# EAGLE design 210_gpio (EAGLE 9.6.2)
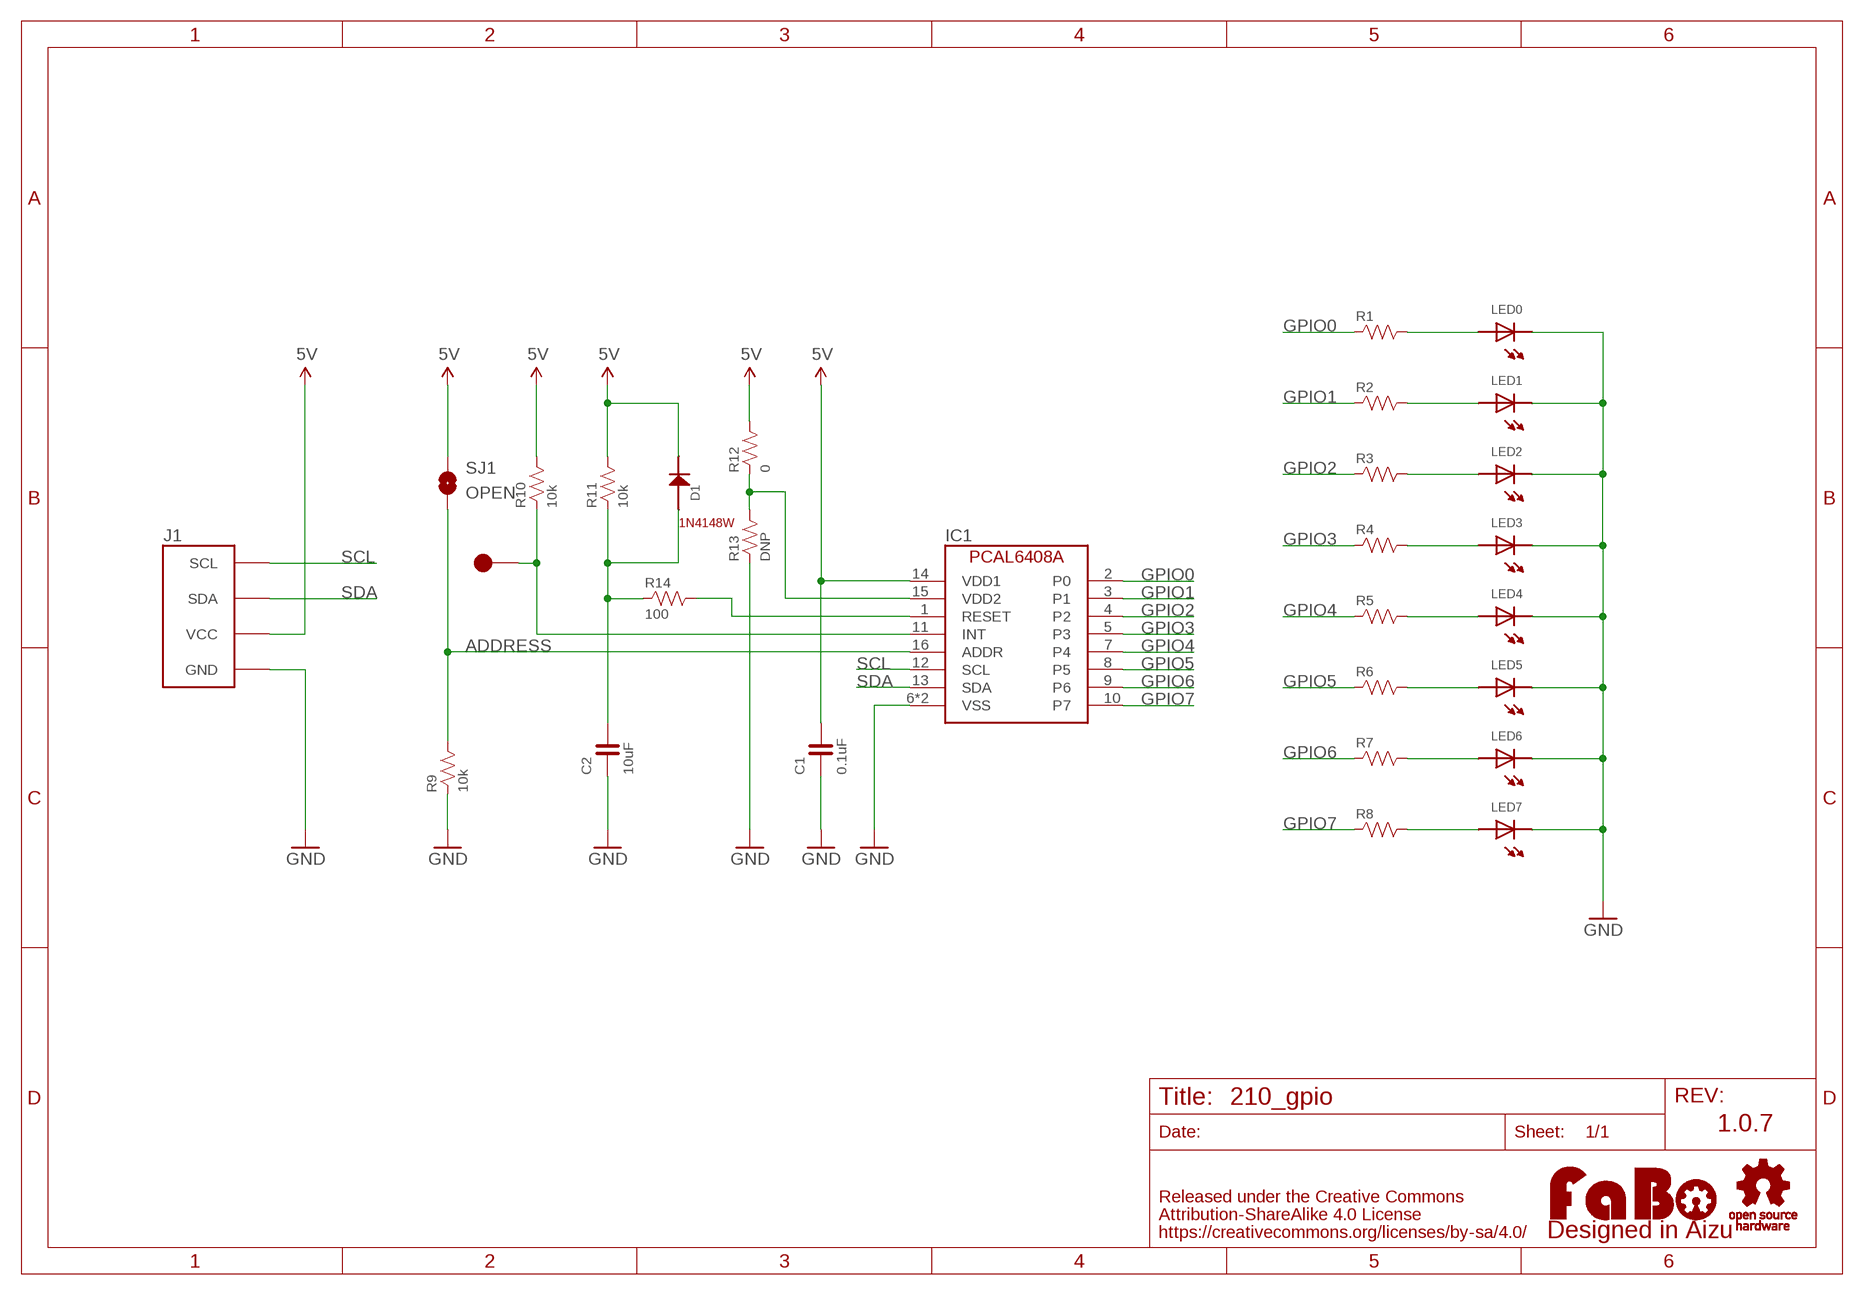
[diagram p0: schematic, sheet 1]

## Parts
C1  0.1uF  CAPACITOR-0603  [0603]
C2  10uF  CAPACITOR-0805  [0805]
D1  1N4148  [1N4148W]
IC1  NX-PCAL6408A  [NXP-PCAL6408A]
J1  FABO_BRICK_I2C  [FABO_BRICK_I2C]
LED0  LED-0603-NARROW  [0603-NARROW]
LED1  LED-0603-NARROW  [0603-NARROW]
LED2  LED-0603-NARROW  [0603-NARROW]
LED3  LED-0603-NARROW  [0603-NARROW]
LED4  LED-0603-NARROW  [0603-NARROW]
LED5  LED-0603-NARROW  [0603-NARROW]
LED6  LED-0603-NARROW  [0603-NARROW]
LED7  LED-0603-NARROW  [0603-NARROW]
LOGO1  LOGO_FABO-M  [LOGO_FABO_M]
R1  RESISTOR-0603-NARROW  [0603-NARROW]
R2  RESISTOR-0603-NARROW  [0603-NARROW]
R3  RESISTOR-0603-NARROW  [0603-NARROW]
R4  RESISTOR-0603-NARROW  [0603-NARROW]
R5  RESISTOR-0603-NARROW  [0603-NARROW]
R6  RESISTOR-0603-NARROW  [0603-NARROW]
R7  RESISTOR-0603-NARROW  [0603-NARROW]
R8  RESISTOR-0603-NARROW  [0603-NARROW]
R9  10k  RESISTOR-0603-NARROW  [0603-NARROW]
R10  10k  RESISTOR-0603-NARROW  [0603-NARROW]
R11  10k  RESISTOR-0603-NARROW  [0603-NARROW]
R12  0  RESISTOR-0603-NARROW  [0603-NARROW]
R13  DNP  RESISTOR-0603-NARROW  [0603-NARROW]
R14  100  RESISTOR-0603-NARROW  [0603-NARROW]
SJ1  OPEN  SMD-JUMPER-2-OPEN  [SMD-JUMPER-2-OPEN]
TP1  TP-15  [TP-15]
U$2  LOGO_OSHW-M_BOTTOM  [LOGO_OSHW_M_BOTTOM]

## Nets
5V: C1.2 D1.CATHODE IC1.14(VDD1) J1.VCC R10.2 R11.2 R12.2 SJ1.1
ADDRESS: IC1.16(ADDR) R9.2 SJ1.2
GND: C1.1 C2.1 IC1.6(VSS) IC1.17(VSS) J1.GND LED0.CATHODE LED1.CATHODE LED2.CATHODE LED3.CATHODE LED4.CATHODE LED5.CATHODE LED6.CATHODE LED7.CATHODE R9.1 R13.1
GPIO0: IC1.2(P0) R1.1
GPIO1: IC1.3(P1) R2.1
GPIO2: IC1.4(P2) R3.1
GPIO3: IC1.5(P3) R4.1
GPIO4: IC1.7(P4) R5.1
GPIO5: IC1.8(P5) R6.1
GPIO6: IC1.9(P6) R7.1
GPIO7: IC1.10(P7) R8.1
N$1: LED0.ANODE R1.2
N$2: LED1.ANODE R2.2
N$3: LED2.ANODE R3.2
N$4: LED3.ANODE R4.2
N$5: LED4.ANODE R5.2
N$6: LED5.ANODE R6.2
N$7: LED6.ANODE R7.2
N$8: LED7.ANODE R8.2
N$9: IC1.11(INT) R10.1 TP1.1
N$10: C2.2 D1.ANODE R11.1 R14.1
N$11: IC1.1(RESET) R14.2
N$12: IC1.15(VDD2) R12.1 R13.2
SCL: IC1.12(SCL) J1.SCL
SDA: IC1.13(SDA) J1.SDA

## Notes on the sheet
- 1N4148W
- 1.0.7

## Library data of the parts
C1 C2 = FaBo-Capacitor:CAPACITOR: CAPACITOR
D1 = FaBo-Diode:1N4148
IC1 = FaBo-Mems:NX-PCAL6408A: NXP PCAL6408A
J1 = FaBo-Template:FABO_BRICK_I2C: FaBo Brick I2C
LED0 LED1-LED7 = FaBo-LED:LED
LOGO1 = component:LOGO_FABO
R1-R14 = FaBo-Resistors:RESISTOR: RESISTOR
SJ1 = FaBo-Supply:SMD-JUMPER-2
TP1 = FaBo-Supply:TP
U$2 = FaBo-etc:LOGO_OSHW

## Board
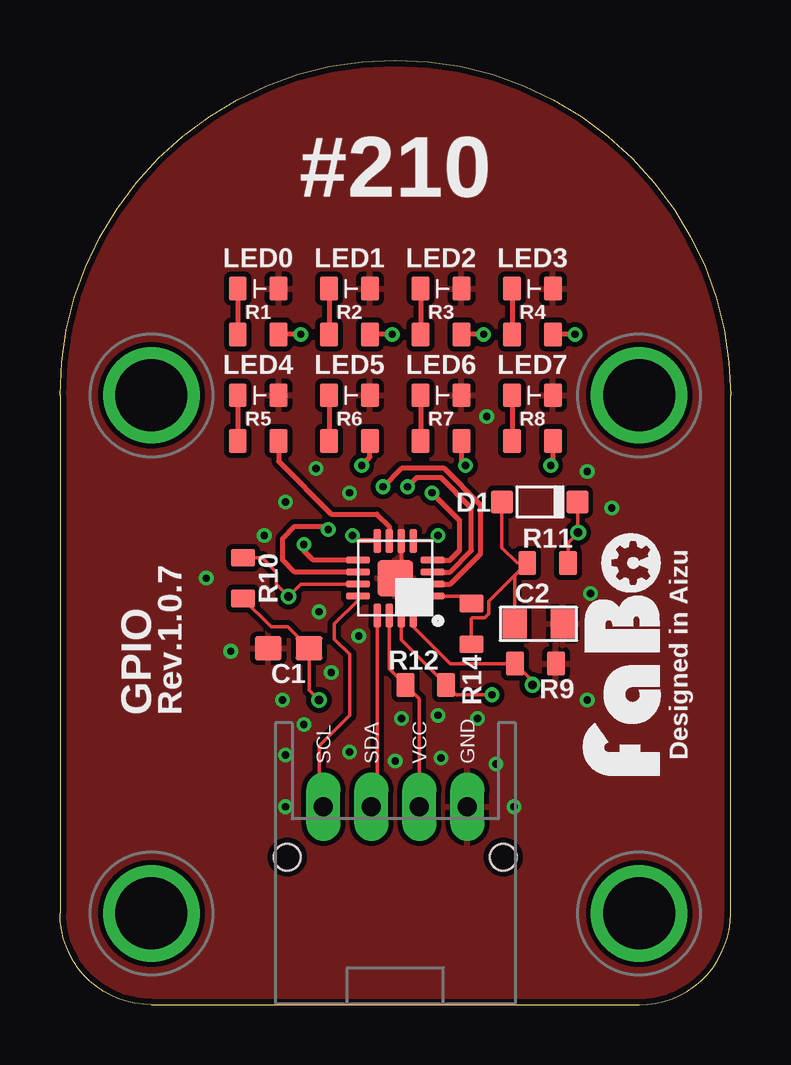
[diagram p1: board, top side]
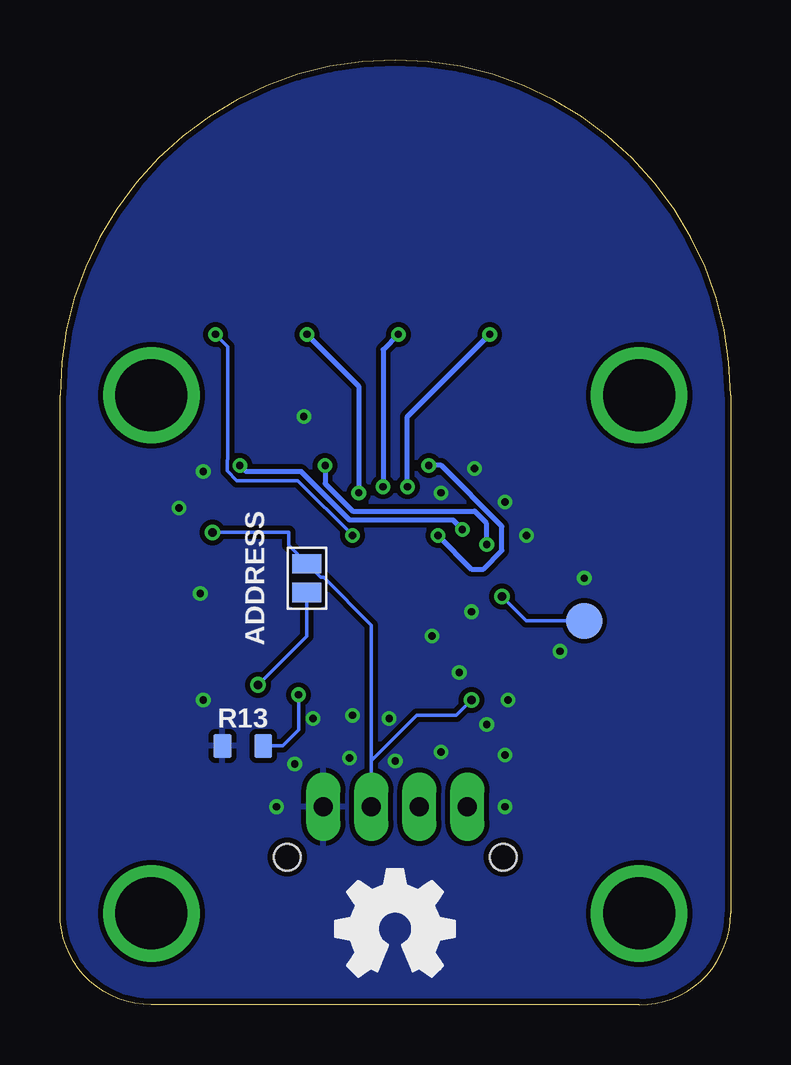
[diagram p2: board, bottom side, seen from below]

Size 27.94 x 39.37 mm. Coordinates in mm from the lower left corner, seen from the top.
Copper layers (1*16): Top 0.035mm / dielectric 1.6mm / Bottom 0.035mm
Design rules "PCBway": minimum track width 6mil, minimum drill 12mil, track to track 6mil, track to pad 6mil, pad to pad 6mil, via to via 6mil, smd to smd 6mil, copper to edge 10mil, drill to drill 10mil, minimum pad ring 10mil, minimum via ring 6mil, stop-mask expansion 2mil, vias tented up to drill 100mil, thermal gap 8mil

### Footprints (pad centres in the part's own frame; a part is rotated, then mirrored left to right if it is on the bottom)
0603 = smd 1.1 x 1: 1 -0.85,0; 2 0.85,0
0805 = smd 1 x 1.2: 1 -1.254,0; 2 0.746,0
1N4148W = smd 0.9 x 0.95: ANODE 0,0; CATHODE 3.15,0
NXP-PCAL6408A = smd 1 x 0.3: 1 -1.55,0.75; 2 -1.55,0.25; 3 -1.55,-0.25; 4 -1.55,-0.75; 9 1.55,-0.75; 10 1.55,-0.25; 11 1.55,0.25; 12 1.55,0.75 | smd 0.3 x 1: 5 -0.75,-1.55; 6 -0.25,-1.55; 7 0.25,-1.55; 8 0.75,-1.55; 13 0.75,1.55; 14 0.25,1.55; 15 -0.25,1.55; 16 -0.75,1.55 | smd 1.5 x 1.5: 17 0,0
FABO_BRICK_I2C = drill 0.8 pad 1.422 long: GND 3,-10.795; SCL -3,-10.795; SDA -1,-10.795; VCC 1,-10.795 | drill 3 pad 3.81: P$1 -10.16,6.35; P$2 10.16,6.35; P$3 -10.16,-15.24; P$4 10.16,-15.24 | hole 1.1: -4.5,-12.895; 4.5,-12.895
0603-NARROW = smd 0.75 x 1: ANODE -0.85,0; CATHODE 0.85,0
0603-NARROW' = smd 0.75 x 1: 1 -0.85,0; 2 0.85,0
SMD-JUMPER-2-OPEN = smd 0.8 x 1.2: 1 -0.6,0; 2 0.6,0
TP-15 = smd 1.5 x 1.5: 1 0,0

### Placement (x,y rotation side)
C1  9.53,14.86 0 top
C2  19.68,15.88 180 top
D1  18.41,20.95 0 top
IC1  13.97,17.78 180 top
J1  13.97,19.05 0 top
LED0  8.26,29.84 0 top
LED1  12.06,29.84 0 top
LED2  15.88,29.84 0 top
LED3  19.68,29.84 0 top
LED4  8.26,25.4 0 top
LED5  12.06,25.4 0 top
LED6  15.88,25.4 0 top
LED7  19.68,25.4 0 top
LOGO1  25.4,14.61 90 top
R1  [0603-NARROW']  8.26,27.94 180 top
R2  [0603-NARROW']  12.06,27.94 180 top
R3  [0603-NARROW']  15.88,27.94 180 top
R4  [0603-NARROW']  19.68,27.94 180 top
R5  [0603-NARROW']  8.26,23.5 180 top
R6  [0603-NARROW']  12.06,23.5 180 top
R7  [0603-NARROW']  15.88,23.5 180 top
R8  [0603-NARROW']  19.68,23.5 180 top
R9  10k  [0603-NARROW']  19.81,14.22 180 top
R10  10k  [0603-NARROW']  7.62,17.78 270 top
R11  10k  [0603-NARROW']  20.32,18.41 0 top
R12  0  [0603-NARROW']  15.24,13.34 180 top
R13  DNP  [0603-NARROW']  20.32,10.79 0 bottom
R14  100  [0603-NARROW']  17.14,15.88 90 top
SJ1  17.65,17.78 270 bottom
TP1  6.1,16 270 bottom
U$2  13.97,3.17 0 top

### Tracks (layer width: path | path; a pad name or v marks a point on that pad's centre or on a via)
5V  (via drill 0.35)
  Top 0.152: R11.2 21.17,19.27 v21.59,19.68 21.57,19.71 D1.CATHODE | R10.2 8.8,15.75 9.49,15.75 C1.2 10.38,13.12 v10.79,12.7 | IC1.14 13.72,14.01 R12.2 14.97,12.76 J1.VCC
  Bottom 0.152: v21.59,19.68 18.41,19.68 18.41,19.14 SJ1.1 17.08,17.81 16.96,17.81 14.97,15.82 J1.VCC 14.97,10.18 13.08,12.06 11.43,12.06 v10.79,12.7
ADDRESS  (via drill 0.35)
  Top 0.152: 14.72,16.14 14.72,15.76 16.26,14.22 R9.2 19.68,13.5 v19.68,13.34
  Top 0.203: IC1.16 14.72,16.14
  Bottom 0.152: v19.68,13.34 17.65,15.37 SJ1.2
GND  (via drill 0.3)
  Top 0.152: IC1.6 14.22,18.03 IC1.17
  other vias: 12.06,10.54 12.45,15.37 11.3,13.84 10.16,11.68 13.97,10.16 15.88,10.29 15.75,12.06 10.79,16.38 8.51,19.56 9.4,20.95 10.67,22.35 12.06,21.34 17.78,24.51 21.97,22.23 22.99,20.7 22.1,17.14 9.27,12.7 7.11,14.73 6.1,17.78 9.4,8.26 9.4,10.41 18.92,8.26 21.97,12.7 17.4,11.94 18.16,10.03 14.22,11.94
  pour Top (isolate 0.203): 0,0 27.94,0 27.94,39.37 0,39.37
  pour Bottom (isolate 0.203): 0,0 27.94,0 27.94,39.37 0,39.37
GPIO0  (via drill 0.3)
  Top 0.203: IC1.2 16.26,17.53 17.53,18.8 17.53,20.83 16,22.35 14.22,22.35 v13.46,21.59 | v10.03,27.94 R1.1
  Bottom 0.203: v13.46,21.59 13.46,24.51 v10.03,27.94
GPIO1  (via drill 0.3)
  Top 0.203: IC1.3 16.25,18.03 17.14,18.92 17.14,20.7 15.88,21.97 14.86,21.97 v14.48,21.59 | v13.84,27.94 R2.1
  Bottom 0.203: v13.84,27.94 14.48,27.3 v14.48,21.59
GPIO2  (via drill 0.3)
  Top 0.203: IC1.4 16.24,18.53 16.64,18.92 16.64,20.19 v15.49,21.34 | v17.65,27.94 R3.1
  Bottom 0.203: v17.65,27.94 15.49,25.78 v15.49,21.34
GPIO3  (via drill 0.3)
  Top 0.152: IC1.5 15.52,19.33 v15.75,19.56
  Top 0.203: v21.46,27.94 R4.1
  Bottom 0.152: v15.75,19.56 18.03,21.84 20.57,21.84 20.98,22.25 20.98,22.7 20.95,22.73 20.95,27.43 v21.46,27.94
GPIO4
  Top 0.203: IC1.7 13.72,19.94 13.21,20.45 11.3,20.45 9.11,22.64 R5.1
GPIO5  (via drill 0.3)
  Top 0.203: IC1.8 12.42,19.33 v12.19,19.56 | v12.57,22.48 12.91,22.82 R6.1
  Bottom 0.203: v12.19,19.56 10.79,18.16 10.29,18.16 9.53,18.92 9.53,19.94 12.06,22.48 v12.57,22.48
GPIO6  (via drill 0.3)
  Top 0.203: IC1.9 10.55,18.53 10.16,18.92 v10.16,19.18 | R7.1 16.73,22.64 v16.89,22.48
  Bottom 0.203: v10.16,19.18 10.16,20.07 10.67,20.57 15.75,20.57 16.89,21.72 v16.89,22.48
GPIO7  (via drill 0.3)
  Top 0.203: IC1.10 9.78,18.03 9.27,18.54 9.27,19.43 9.78,19.94 11.05,19.94 v11.18,19.81 | R8.1 20.54,22.57 v20.45,22.48
  Bottom 0.203: v20.45,22.48 20.19,22.23 17.91,22.23 15.88,20.19 11.56,20.19 v11.18,19.81
N$1
  Top 0.203: LED0.ANODE R1.2
N$2
  Top 0.203: LED1.ANODE R2.2
N$3
  Top 0.203: LED2.ANODE R3.2
N$4
  Top 0.203: LED3.ANODE R4.2
N$5
  Top 0.203: LED4.ANODE R5.2
N$6
  Top 0.203: LED5.ANODE R6.2
N$7
  Top 0.203: LED6.ANODE R7.2
N$8
  Top 0.203: LED7.ANODE R8.2
N$9  (via drill 0.35)
  Top 0.152: IC1.11 10.04,17.53 v9.53,17.02 9.02,17.53 9.02,18.03 8.42,18.63 R10.1
  Bottom 0.152: v9.53,17.02 8.51,16 TP1.1
N$10
  Top 0.152: C2.2 18.94,17.88 R11.1 | R14.1 17.14,16.09 17.18,16.12 17.7,16.12 17.87,16.3 17.87,16.82 R11.1 | R11.1 19.05,18.41 18.41,19.05 D1.ANODE
N$11
  Top 0.152: IC1.1 16.84,17.03 R14.2
N$12  (via drill 0.3)
  Top 0.152: IC1.15 14.22,15.21 R12.1 16.5,12.92 v18,12.92
  Bottom 0.152: R13.2 18.67,10.79 18,11.46 v18,12.92
SCL
  Top 0.152: IC1.12 12.42,16.86 11.43,15.88 11.43,15.24 12.06,14.61 12.06,12.06 10.79,10.79 10.79,8.43 J1.SCL
SDA
  Top 0.152: IC1.13 13.22,8.51 J1.SDA

### Text on the board
tPlace: #210 | Designed in Aizu | GPIO | Rev.1.0.7
bPlace: ADDRESS